# Altium project CPU.PrjPcb (part 2 of 2)
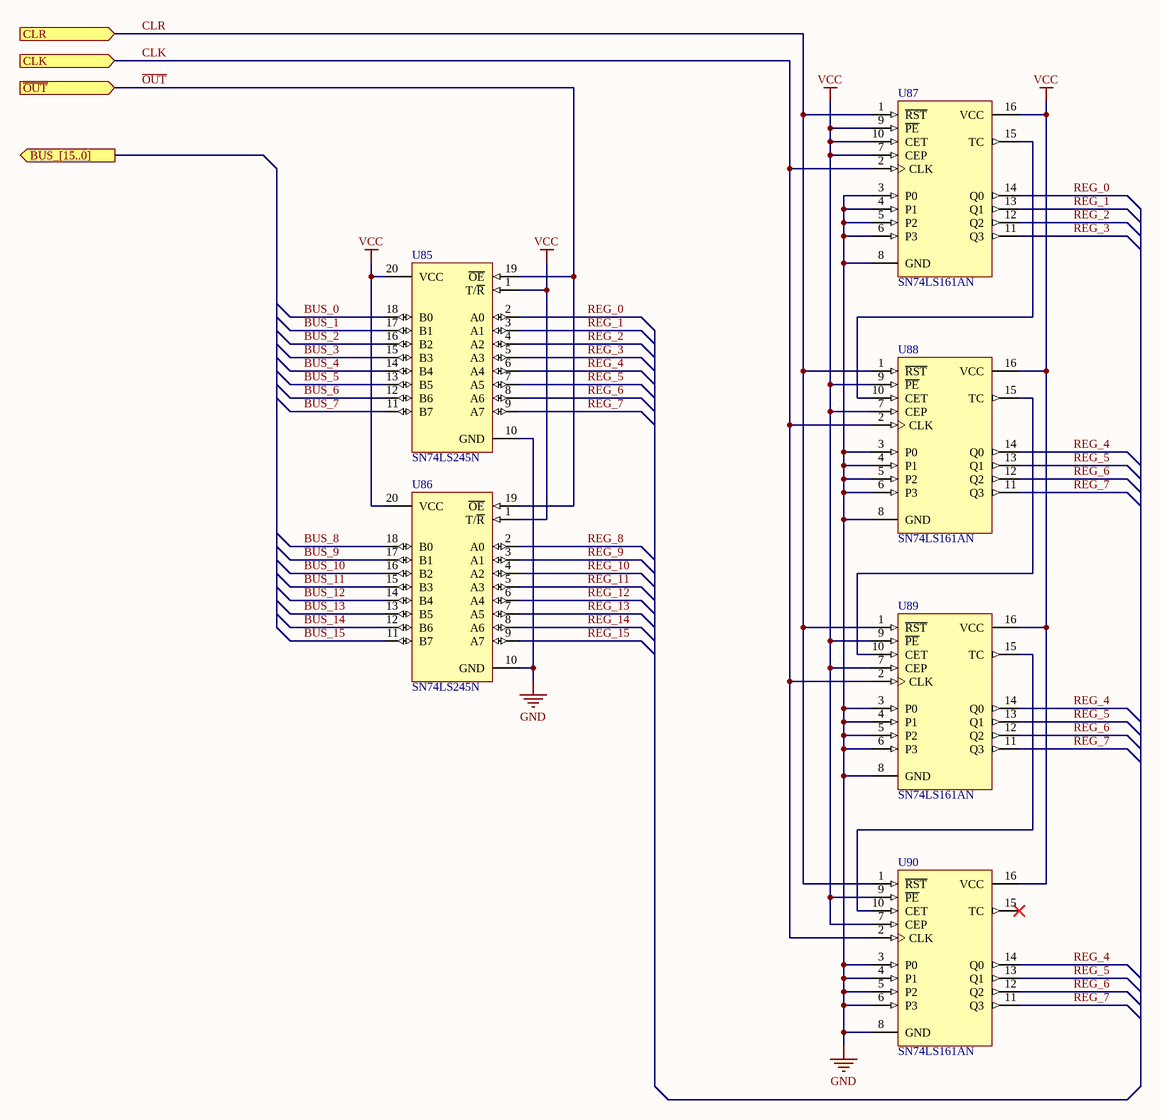
[diagram p11: Timer_Register.SchDoc]

## Nets that join several sheets
GND: REG_A (14 pins), REG_B (14 pins), ALU (11 pins), ALU_Adder (6 pins), ALU_AND (6 pins), ALU_OR (6 pins), ALU_XOR (6 pins), ALU_Shifter (14 pins), ALU_ZF (U75.7 U76.7 U77.7), ALU_ONES (U?#1.10 U?#2.10), Timer_Register (22 pins)
VCC: REG_A (8 pins), REG_B (8 pins), ALU (7 pins), ALU_Adder (8 pins), ALU_AND (8 pins), ALU_OR (8 pins), ALU_XOR (8 pins), ALU_Shifter (16 pins), ALU_ZF (U75.14 U76.14 U77.14), ALU_ONES (20 pins), Timer_Register (17 pins)
~{ADD_OUT}: ALU (U25#1.6), ALU_Adder (U27.19 U28.19)
~{AND}: ALU (U23.12), ALU_AND (U33.19 U34.19)
A_0: ALU_Adder (U29.5), ALU_AND (U35.1), ALU_OR (U41.1), ALU_XOR (U47.1), ALU_Shifter (U54.2 U54.4)
A_1: ALU_Adder (U29.3), ALU_AND (U35.4), ALU_OR (U41.4), ALU_XOR (U47.4), ALU_Shifter (U54.10 U54.12)
A_2: ALU_Adder (U29.14), ALU_AND (U35.9), ALU_OR (U41.9), ALU_XOR (U47.9), ALU_Shifter (U55.2 U55.4)
A_3: ALU_Adder (U29.12), ALU_AND (U35.12), ALU_OR (U41.12), ALU_XOR (U47.12), ALU_Shifter (U55.10 U55.12)
A_4: ALU_Adder (U30.5), ALU_AND (U36.1), ALU_OR (U42.1), ALU_XOR (U48.1), ALU_Shifter (U56.2 U56.4)
A_5: ALU_Adder (U30.3), ALU_AND (U36.4), ALU_OR (U42.4), ALU_XOR (U48.4), ALU_Shifter (U56.10 U56.12)
A_6: ALU_Adder (U30.14), ALU_AND (U36.9), ALU_OR (U42.9), ALU_XOR (U48.9), ALU_Shifter (U57.2 U57.4)
A_7: ALU_Adder (U30.12), ALU_AND (U36.12), ALU_OR (U42.12), ALU_XOR (U48.12), ALU_Shifter (U57.10 U57.12)
A_8: ALU_Adder (U31.5), ALU_AND (U37.1), ALU_OR (U43.1), ALU_XOR (U49.1), ALU_Shifter (U60.2 U60.4)
A_9: ALU_Adder (U31.3), ALU_AND (U37.4), ALU_OR (U43.4), ALU_XOR (U49.4), ALU_Shifter (U60.10 U60.12)
A_10: ALU_Adder (U31.14), ALU_AND (U37.9), ALU_OR (U43.9), ALU_XOR (U49.9), ALU_Shifter (U61.2 U61.4)
A_11: ALU_Adder (U31.12), ALU_AND (U37.12), ALU_OR (U43.12), ALU_XOR (U49.12), ALU_Shifter (U61.10 U61.12)
A_12: ALU_Adder (U32.5), ALU_AND (U38.1), ALU_OR (U44.1), ALU_XOR (U50.1), ALU_Shifter (U62.2 U62.4)
A_13: ALU_Adder (U32.3), ALU_AND (U38.4), ALU_OR (U44.4), ALU_XOR (U50.4), ALU_Shifter (U62.10 U62.12)
A_14: ALU_Adder (U32.14), ALU_AND (U38.9), ALU_OR (U44.9), ALU_XOR (U50.9), ALU_Shifter (U63.2 U63.4)
A_15: ALU_Adder (U32.12), ALU_AND (U38.12), ALU_OR (U44.12), ALU_XOR (U50.12), ALU_Shifter (U63.10 U63.12)
B_0: ALU_Adder (U29.6), ALU_AND (U35.2), ALU_OR (U41.2), ALU_XOR (U47.2)
B_1: ALU_Adder (U29.2), ALU_AND (U35.5), ALU_OR (U41.5), ALU_XOR (U47.5)
B_2: ALU_Adder (U29.15), ALU_AND (U35.10), ALU_OR (U41.10), ALU_XOR (U47.10)
B_3: ALU_Adder (U29.11), ALU_AND (U35.13), ALU_OR (U41.13), ALU_XOR (U47.13)
B_4: ALU_Adder (U30.6), ALU_AND (U36.2), ALU_OR (U42.2), ALU_XOR (U48.2)
B_5: ALU_Adder (U30.2), ALU_AND (U36.5), ALU_OR (U42.5), ALU_XOR (U48.5)
B_6: ALU_Adder (U30.15), ALU_AND (U36.10), ALU_OR (U42.10), ALU_XOR (U48.10)
B_7: ALU_Adder (U30.11), ALU_AND (U36.13), ALU_OR (U42.13), ALU_XOR (U48.13)
B_8: ALU_Adder (U31.6), ALU_AND (U37.2), ALU_OR (U43.2), ALU_XOR (U49.2)
B_9: ALU_Adder (U31.2), ALU_AND (U37.5), ALU_OR (U43.5), ALU_XOR (U49.5)
B_10: ALU_Adder (U31.15), ALU_AND (U37.10), ALU_OR (U43.10), ALU_XOR (U49.10)
B_11: ALU_Adder (U31.11), ALU_AND (U37.13), ALU_OR (U43.13), ALU_XOR (U49.13)
B_12: ALU_Adder (U32.6), ALU_AND (U38.2), ALU_OR (U44.2), ALU_XOR (U50.2)
B_13: ALU_Adder (U32.2), ALU_AND (U38.5), ALU_OR (U44.5), ALU_XOR (U50.5)
B_14: ALU_Adder (U32.15), ALU_AND (U38.10), ALU_OR (U44.10), ALU_XOR (U50.10)
B_15: ALU_Adder (U32.11), ALU_AND (U38.13), ALU_OR (U44.13), ALU_XOR (U50.13)
BUS_0: ALU_Adder (U27.18), ALU_AND (U33.18), ALU_OR (U39.18), ALU_XOR (U45.18), ALU_Shifter (U52.18), ALU_ONES (U?#1.18)
BUS_1: ALU_Adder (U27.17), ALU_AND (U33.17), ALU_OR (U39.17), ALU_XOR (U45.17), ALU_Shifter (U52.17), ALU_ONES (U?#1.17)
BUS_2: ALU_Adder (U27.16), ALU_AND (U33.16), ALU_OR (U39.16), ALU_XOR (U45.16), ALU_Shifter (U52.16), ALU_ONES (U?#1.16)
BUS_3: ALU_Adder (U27.15), ALU_AND (U33.15), ALU_OR (U39.15), ALU_XOR (U45.15), ALU_Shifter (U52.15), ALU_ONES (U?#1.15)
BUS_4: ALU_Adder (U27.14), ALU_AND (U33.14), ALU_OR (U39.14), ALU_XOR (U45.14), ALU_Shifter (U52.14), ALU_ONES (U?#1.14)
BUS_5: ALU_Adder (U27.13), ALU_AND (U33.13), ALU_OR (U39.13), ALU_XOR (U45.13), ALU_Shifter (U52.13), ALU_ONES (U?#1.13)
BUS_6: ALU_Adder (U27.12), ALU_AND (U33.12), ALU_OR (U39.12), ALU_XOR (U45.12), ALU_Shifter (U52.12), ALU_ONES (U?#1.12)
BUS_7: ALU_Adder (U27.11), ALU_AND (U33.11), ALU_OR (U39.11), ALU_XOR (U45.11), ALU_Shifter (U52.11), ALU_ONES (U?#1.11)
BUS_8: ALU_Adder (U28.18), ALU_AND (U34.18), ALU_OR (U40.18), ALU_XOR (U46.18), ALU_Shifter (U53.18), ALU_ONES (U?#2.18)
BUS_9: ALU_Adder (U28.17), ALU_AND (U34.17), ALU_OR (U40.17), ALU_XOR (U46.17), ALU_Shifter (U53.17), ALU_ONES (U?#2.17)
BUS_10: ALU_Adder (U28.16), ALU_AND (U34.16), ALU_OR (U40.16), ALU_XOR (U46.16), ALU_Shifter (U53.16), ALU_ONES (U?#2.16)
BUS_11: ALU_Adder (U28.15), ALU_AND (U34.15), ALU_OR (U40.15), ALU_XOR (U46.15), ALU_Shifter (U53.15), ALU_ONES (U?#2.15)
BUS_12: ALU_Adder (U28.14), ALU_AND (U34.14), ALU_OR (U40.14), ALU_XOR (U46.14), ALU_Shifter (U53.14), ALU_ONES (U?#2.14)
BUS_13: ALU_Adder (U28.13), ALU_AND (U34.13), ALU_OR (U40.13), ALU_XOR (U46.13), ALU_Shifter (U53.13), ALU_ONES (U?#2.13)
BUS_14: ALU_Adder (U28.12), ALU_AND (U34.12), ALU_OR (U40.12), ALU_XOR (U46.12), ALU_Shifter (U53.12), ALU_ONES (U?#2.12)
BUS_15: ALU_Adder (U28.11), ALU_AND (U34.11), ALU_OR (U40.11), ALU_XOR (U46.11), ALU_Shifter (U53.11), ALU_ONES (U?#2.11)
CLK: REG_A (U19_REG_A.7 U20_REG_A.7 U21_REG_A.7 U22_REG_A.7), REG_B (U19_REG_B.7 U20_REG_B.7 U21_REG_B.7 U22_REG_B.7), ALU (U78.7)
CLR: REG_A (U19_REG_A.15 U20_REG_A.15 U21_REG_A.15 U22_REG_A.15), REG_B (U19_REG_B.15 U20_REG_B.15 U21_REG_B.15 U22_REG_B.15), ALU (U78.15), Timer_Register (U87.1 U88.1 U89.1 U90.1)
LEFT: ALU (U25#1.8 U26.4), ALU_Shifter (16 pins)
NetU25#2_1: ALU (U25#2.1), ALU_ZF (U77.8)
~{ONES}: ALU (U24.15), ALU_ONES (U?#1.19 U?#2.19)
~{OR}: ALU (U23.11), ALU_OR (U39.19 U40.19)
~{OUT}: ALU (U23.10), ALU_XOR (U45.19 U46.19)
~{OUT}: ALU (U25#1.12), ALU_Shifter (U52.19 U53.19)
RIGHT: ALU (U25#1.10 U26.5), ALU_Shifter (16 pins)
SUB: ALU (U25#1.4 U26.2), ALU_Adder (U29.7)